# EAGLE design pinguino32 (EAGLE 6.1)
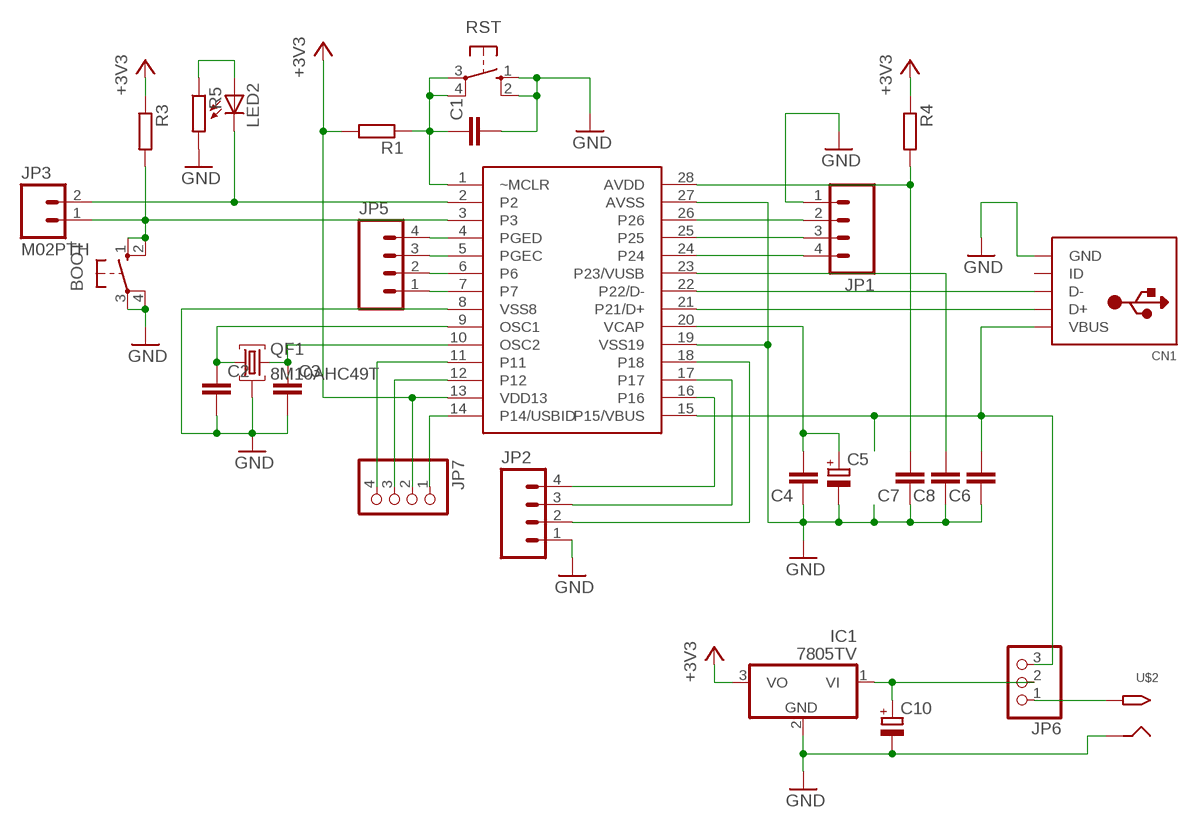
[diagram p0: schematic, sheet 1]

## Parts
BOOT  10-XX  [B3F-10XX]
C1  C-EU025-025X050  [C025-025X050]
C2  C-EU025-025X050  [C025-025X050]
C3  C-EU025-025X050  [C025-025X050]
C4  C-EU025-025X050  [C025-025X050]
C5  CPOL-EUE2,5-6E  [E2,5-6E]
C6  C-EU025-025X050  [C025-025X050]
C7  C-EU025-025X050  [C025-025X050]
C8  C-EU025-025X050  [C025-025X050]
C10  CPOL-EUE2,5-6E  [E2,5-6E]
CN1  USBTHM  [USB-MINIB-THM]
IC1  7805TV  [TO220V]
JP1  M04PTH  [1X04]
JP2  M04PTH  [1X04]
JP3  M02PTH  [1X02]
JP5  M04PTH  [1X04]
JP6  PINHD-1X3  [1X03]
JP7  PINHD-1X4  [1X04]
LED2  LED3MM  [LED3MM]
QF1  8M10AHC49T  [HC49U]
R1  R-EU_0204/7  [0204/7]
R3  R-EU_0204/2V  [0204V]
R4  R-EU_0204/7  [0204/7]
R5  R-EU_0204/7  [0204/7]
RST  10-XX  [B3F-10XX]
U$1  PIC32DIP  [SOCKET-28-3]
U$2  2.1MMJACKTHM  [PJ-102A]

## Nets
+3V3: IC1.3(VO) JP7.2 R1.2 R3.1 R4.1 U$1.13(VDD13)
GND: BOOT.3(P) BOOT.4(P1) C1.2 C2.2 C3.2 C4.1 C5.- C6.1 C7.1 C8.1 C10.- CN1.GND IC1.2(GND) JP1.1 JP2.1 QF1.2 R5.2 RST.1(S) RST.2(S1) U$1.8(VSS8) U$1.19(VSS19) U$1.27(AVSS) U$2.RING
N$1: C1.1 R1.1 RST.3(P) RST.4(P1) U$1.1(~MCLR)
N$2: JP3.2 LED2.K(C) U$1.2
N$3: LED2.A R5.1
N$4: JP5.1 U$1.7
N$5: JP5.2 U$1.6
N$6: JP5.3 U$1.5(PGEC)
N$7: JP5.4 U$1.4(PGED)
N$8: BOOT.1(S) BOOT.2(S1) JP3.1 R3.2 U$1.3
N$11: C6.2 CN1.VBUS JP6.3 U$1.15(P15/VBUS)
N$12: C7.2 R4.2 U$1.28(AVDD)
N$13: JP7.1 U$1.14(P14/USBID)
N$14: JP7.3 U$1.12
N$15: JP7.4 U$1.11
N$16: JP2.4 U$1.16
N$17: JP2.3 U$1.17
N$18: JP2.2 U$1.18
N$19: JP6.1 U$2.TIP
N$20: CN1.D- U$1.22(P22/D-)
N$21: CN1.D+ U$1.21(P21/D+)
N$22: C4.2 C5.+ U$1.20(VCAP)
N$23: C10.+ IC1.1(VI) JP6.2
N$24: C8.2 U$1.23(P23/VUSB)
N$25: JP1.2 U$1.26
N$26: JP1.3 U$1.25
N$27: JP1.4 U$1.24
N$31: C3.1 QF1.3 U$1.10(OSC2)
N$32: C2.1 QF1.1 U$1.9(OSC1)
Unconnected: CN1.ID

## Library data of the parts
BOOT RST = switch-omron (2):10-XX: OMRON SWITCH
C1-C4 C6-C8 = rcl:C-EU: CAPACITOR, European symbol
C5 C10 = rcl:CPOL-EU: POLARIZED CAPACITOR, European symbol
CN1 = adafruit:USB: USB Connectors USBMINIB - Surface Mount Female Mini-B USB Connector 4UConnector: 06564 By microbuilder.eu Thru-hole RA Female Mini-B USB Connector 4UConnector: 18732 By ladyada.net
IC1 = linear:78*: Positive VOLTAGE REGULATOR Source: http://cache.national.com/ds/LM/LM78L05.pdf http://www.fairchildsemi.com/ds/LM/LM7805.pdf
JP1 JP2 JP5 = SparkFun-Connectors:M04: Header 4 Standard 4-pin 0.1" header. Use with straight break away headers (SKU : PRT-00116), right angle break away headers (PRT-00553), swiss pins (PRT-00743), machine pins (PRT-00117), and female headers (PRT-00115). Molex polarized connector foot print use with SKU : PRT-08231 with associated crimp pins and housings. 1MM SMD Version SKU: PRT-10208
JP3 = SparkFun-Connectors:M02: Standard 2-pin 0.1" header. Use with - straight break away headers ( PRT-00116) - right angle break away headers (PRT-00553) - swiss pins (PRT-00743) - machine pins (PRT-00117) - female headers (PRT-00115) Molex polarized connector foot print use with: PRT-08233 with associated crimp pins and housings. 2.54_SCREWTERM for use with PRT-10571. 3.5mm Screw Terminal footprints for PRT-08084 5mm Screw Terminal footprints for use with PRT-08432
JP6 = pinhead:PINHD-1X3: PIN HEADER
JP7 = _MY_OWN_LIB:PINHD-1X4: PIN HEADER
LED2 = led:LED: LED OSRAM: - CHIPLED LG R971, LG N971, LY N971, LG Q971, LY Q971, LO R971, LY R971 LH N974, LH R974 LS Q976, LO Q976, LY Q976 LO Q996 - Hyper CHIPLED LW Q18S LB Q993, LB Q99A, LB R99A - SideLED LS A670, LO A670, LY A670, LG A670, LP A670 LB A673, LV A673, LT A673, LW A673 LH A674 LY A675 LS A676, LA A676, LO A676, LY A676, LW A676 LS A679, LY A679, LG A679 - Hyper Micro SIDELED® LS Y876, LA Y876, LO Y876, LY Y876 LT Y87S - SmartLED LW L88C, LW L88S LB L89C, LB L89S, LG L890 LS L89K, LO L89K, LY L89K LS L896, LA L896, LO L896, LY L896 - TOPLED LS T670, LO T670, LY T670, LG T670, LP T670 LSG T670, LSP T670, LSY T670, LOP T670, LYG T670 LG T671, LOG T671, LSG T671 LB T673, LV T673, LT T673, LW T673 LH T674 LS T676, LA T676, LO T676, LY T676, LB T676, LH T676, LSB T676, LW T676 LB T67C, LV T67C, LT T67C, LS T67K, LO T67K, LY T67K, LW E67C LS E67B, LA E67B, LO E67B, LY E67B, LB E67C, LV E67C, LT E67C LW T67C LS T679, LY T679, LG T679 LS T770, LO T770, LY T770, LG T770, LP T770 LB T773, LV T773, LT T773, LW T773 LH T774 LS E675, LA E675, LY E675, LS T675 LS T776, LA T776, LO T776, LY T776, LB T776 LHGB T686 LT T68C, LB T68C - Hyper Mini TOPLED® LB M676 - Mini TOPLED Santana® LG M470 LS M47K, LO M47K, LY M47K Source: http://www.osram.convergy.de LUXEON: - LUMILED® LXK2-PW12-R00, LXK2-PW12-S00, LXK2-PW14-U00, LXK2-PW14-V00 LXK2-PM12-R00, LXK2-PM12-S00, LXK2-PM14-U00 LXK2-PE12-Q00, LXK2-PE12-R00, LXK2-PE12-S00, LXK2-PE14-T00, LXK2-PE14-U00 LXK2-PB12-K00, LXK2-PB12-L00, LXK2-PB12-M00, LXK2-PB14-N00, LXK2-PB14-P00, LXK2-PB14-Q00 LXK2-PR12-L00, LXK2-PR12-M00, LXK2-PR14-Q00, LXK2-PR14-R00 LXK2-PD12-Q00, LXK2-PD12-R00, LXK2-PD12-S00 LXK2-PH12-R00, LXK2-PH12-S00 LXK2-PL12-P00, LXK2-PL12-Q00, LXK2-PL12-R00 Source: www.luxeon.com KINGBRIGHT: KA-3528ASYC Source: www.kingbright.com
QF1 = crystal:8M10AHC49T: Monolithic Crystal Filters Source: www.vanlong.com; OC_FARNELL: unknown; OC_NEWARK: unknown
R1 R3-R5 = rcl:R-EU_: RESISTOR, European symbol
U$1 = fica2:PIC32DIP
U$2 = _MY_OWN_LIB:2.1MMJACK: 2.1mm x 5.5mm THM DC jack with internal switch. Digikey part #PJ-102A, 4UCON part #05537 2.1mm x 5.5mm SMT DC jack with internal switch. Digikey part #PJ-002A-SMT, 4UCON part #03267 By microbuilder.eu & adafruit.com

## Board
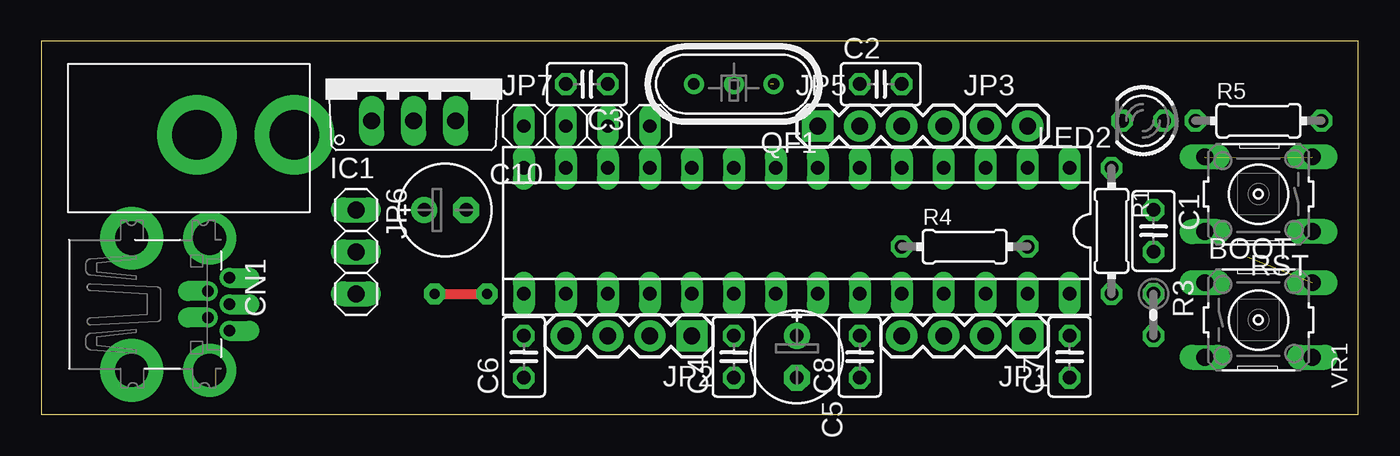
[diagram p1: board, top side]
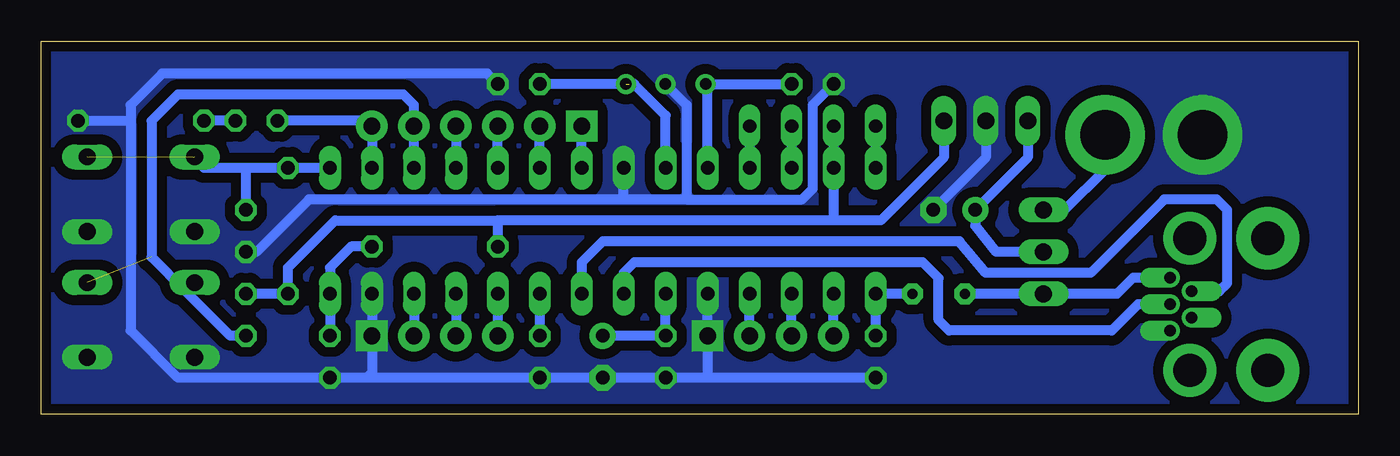
[diagram p2: board, bottom side, seen from below]

Size 79.68 x 22.59 mm. Coordinates in mm from the lower left corner, seen from the top.
Outline: 79.68,0 79.68,22.59 0,22.59 0,0 79.68,0
Copper layers (1*16): Top 0.035mm / dielectric 1.5mm / Bottom 0.035mm
Design rules: minimum track width 6mil, minimum drill 12mil, track to track 6mil, track to pad 6mil, pad to pad 6mil, via to via 6mil, smd to smd 0mil, copper to edge 10mil, drill to drill 10mil, minimum pad ring 10mil, minimum via ring 6mil, stop-mask expansion 2mil, vias tented up to drill 100mil, thermal gap 10mil

### Footprints (pad centres in the part's own frame; a part is rotated, then mirrored left to right if it is on the bottom)
B3F-10XX = drill 1.016 long: 1 -3.251,2.261; 2 3.251,2.261; 3 -3.251,-2.261; 4 3.251,-2.261
C025-025X050 = drill 0.813 octagon: 1 -1.27,0; 2 1.27,0
E2,5-6E = drill 0.813 pad 1.575: + -1.27,0 | drill 0.813 pad 1.575 octagon: - 1.27,0
USB-MINIB-THM = drill 0.7 offset: D+ 0,9.8; D- -0.8,8.5; GND 1.6,9.8; ID 0.8,8.5; VBUS -1.6,9.8 | drill 2 pad 3.81: GND1 -4,3.9; GND4 4,3.9 | drill 2 pad 3.2: GND2 -4,8.6; GND3 4,8.6
TO220V = drill 1.016 long: 1 -2.54,-2.54; 2 0,-2.54; 3 2.54,-2.54
1X04 = drill 1.016 pad 1.88 square: 1 0,0 | drill 1.016 pad 1.88: 2 2.54,0; 3 5.08,0; 4 7.62,0
1X02 = drill 1.016 pad 1.88: 1 0,0; 2 2.54,0
1X03 = drill 1.016 long: 1 -2.54,0; 2 0,0; 3 2.54,0
1X04' = drill 0.8 long: 1 -3.81,0; 2 -1.27,0; 3 1.27,0; 4 3.81,0
LED3MM = drill 0.813 octagon: A -1.27,0; K 1.27,0
HC49U = drill 0.7 pad 1.2: 1 -2.413,0; 2 -0.027,0; 3 2.413,0
0204/7 = drill 0.813 octagon: 1 -3.81,0; 2 3.81,0
0204V = drill 0.813 octagon: 1 -1.27,0; 2 1.27,0
SOCKET-28-3 = drill 0.813 long: 1 -16.51,-3.81; 2 -13.97,-3.81; 3 -11.43,-3.81; 4 -8.89,-3.81; 5 -6.35,-3.81; 6 -3.81,-3.81; 7 -1.27,-3.81; 8 1.27,-3.81; 9 3.81,-3.81; 10 6.35,-3.81; 11 8.89,-3.81; 12 11.43,-3.81; 13 13.97,-3.81; 14 16.51,-3.81; 15 16.51,3.81; 16 13.97,3.81; 17 11.43,3.81; 18 8.89,3.81; 19 6.35,3.81; 20 3.81,3.81; 21 1.27,3.81; 22 -1.27,3.81; 23 -3.81,3.81; 24 -6.35,3.81; 25 -8.89,3.81; 26 -11.43,3.81; 27 -13.97,3.81; 28 -16.51,3.81
PJ-102A = drill 3 pad 4.8: RING 0.1,-3.39; TIP 0.1,-9.29

### Placement (x,y rotation side)
BOOT  73.65,5.71 0 top
C1  67.3,11.11 270 top
C2  50.79,20 0 top
C3  33.01,20 180 top
C4  41.9,3.49 90 top
C5  45.71,3.49 270 top
C6  29.2,3.49 90 top
C7  62.22,3.49 90 top
C8  49.52,3.49 90 top
C10  24.44,12.38 0 top
CN1  1.58,6.67 270 top
IC1  22.53,20.32 0 top
JP1  59.68,4.76 180 top
JP2  39.36,4.76 180 top
JP3  57.14,17.46 0 top
JP5  46.98,17.46 0 top
JP6  19.04,9.84 270 top
JP7  [1X04']  33.01,17.46 0 top
LED2  66.66,17.78 180 top
QF1  41.9,20 180 top
R1  64.76,11.11 270 top
R3  67.3,6.03 270 top
R4  55.87,10.16 0 top
R5  73.65,17.78 0 top
RST  73.65,13.33 180 top
U$1  45.71,11.11 180 top
U$2  6.02,16.83 90 top

### Tracks (layer width: path | path; a pad name or v marks a point on that pad's centre or on a via)
+3V3
  Bottom 0.61: IC1.3 25.07,15.56 28.88,11.75 31.74,11.75 | 31.74,11.75 52.06,11.75 | 52.06,11.75 R4.1 | 31.74,11.75 U$1.13 JP7.2 | R1.2 64.76,7.94 | R1.2 64.76,8.89 61.9,11.75 52.06,11.75 | R1.2 R3.1
GND
  Bottom 0.61: C6.1 39.36,2.22 | 39.36,2.22 C4.1 C5.- C8.1 60,2.22 | 39.36,2.22 JP2.1 U$1.19 | 60,2.22 C7.1 71.43,2.22 74.28,5.08 74.28,17.78 | 60,2.22 59.68,2.54 JP1.1 U$1.27 | C2.2 52.7,20.64 72.38,20.64 74.28,18.73 74.28,17.78 | R5.2 74.28,17.78 | C3.2 33.01,18.73 33.01,13.65 33.65,13.02 40.63,13.02 | 44.44,13.02 U$1.8 | QF1.2 40.63,18.73 40.63,13.02 | IC1.2 22.53,15.56 C10.- | 44.44,13.02 63.49,13.02 66.66,9.84 C1.2 | 40.63,13.02 44.44,13.02
  pour Bottom (isolate 0.61, no thermals): 79.68,0 79.68,22.54 -0.01,22.54 -0.01,0
N$1  (2 unrouted)
  Bottom 0.61: U$1.1 R1.1 67.3,14.92 | 67.3,14.92 69.84,14.92 70.47,15.56 | C1.1 67.3,14.92
N$2
  Bottom 0.61: U$1.2 JP3.2 60,17.78 LED2.K
N$3
  Bottom 0.61: LED2.A R5.1
N$4
  Bottom 0.61: U$1.7 JP5.1
N$5
  Bottom 0.61: U$1.6 JP5.2
N$6
  Bottom 0.61: U$1.5 JP5.3
N$7
  Bottom 0.61: JP5.4 U$1.4
N$8  (1 unrouted)
  Bottom 0.61: JP3.1 U$1.3 57.14,18.73 57.77,19.37 71.43,19.37 73.02,17.78 73.02,9.52 70.95,7.46 | R3.2 68.25,4.76 70.95,7.46 | BOOT.1 70.44,7.98 70.95,7.46
N$11  (via drill 0.6 pad 1.27)
  Top 0.61: v23.8,7.3 v26.98,7.3
  Bottom 0.61: C6.2 U$1.15 v26.98,7.3 | CN1.VBUS 13.63,8.27 14.6,7.3 JP6.3 v23.8,7.3
N$12
  Bottom 0.61: C7.2 U$1.28 62.22,8.89 60.95,10.16 R4.2
N$13
  Bottom 0.61: JP7.1 U$1.14
N$14
  Bottom 0.61: JP7.3 U$1.12
N$15
  Bottom 0.61: JP7.4 U$1.11
N$16
  Bottom 0.61: JP2.4 U$1.16
N$17
  Bottom 0.61: JP2.3 U$1.17
N$18
  Bottom 0.61: JP2.2 U$1.18
N$19
  Bottom 0.61: U$2.TIP 15.31,14.84 17.77,12.38 JP6.1
N$20
  Bottom 0.61: CN1.D- 8.4,7.47 7.93,7.94 7.93,12.38 8.56,13.02 11.74,13.02 16.18,8.57 22.53,8.57 24.12,10.48 45.71,10.48 46.98,9.21 U$1.22
N$21
  Bottom 0.61: U$1.21 44.44,8.57 43.8,9.21 26.34,9.21 25.39,8.25 25.39,5.71 24.75,5.08 14.91,5.08 13.33,6.67 CN1.D+
N$22
  Bottom 0.61: U$1.20 C4.2 C5.+
N$23
  Bottom 0.61: JP6.2 21.9,9.84 23.17,11.43 C10.+ 19.99,15.56 IC1.1
N$24
  Bottom 0.61: U$1.23 C8.2
N$25
  Bottom 0.61: U$1.26 JP1.2
N$26
  Bottom 0.61: U$1.25 JP1.3
N$27
  Bottom 0.61: U$1.24 JP1.4
N$31
  Bottom 0.61: 39.36,20 QF1.3 C3.1 | U$1.10 39.36,20 | 39.36,20 39.36,20.07
N$32  (1 unrouted)
  Bottom 0.61: 44.12,20 C2.1 | U$1.9 41.9,18.1 43.8,20 QF1.1

### Text on the board
tNames: VR1